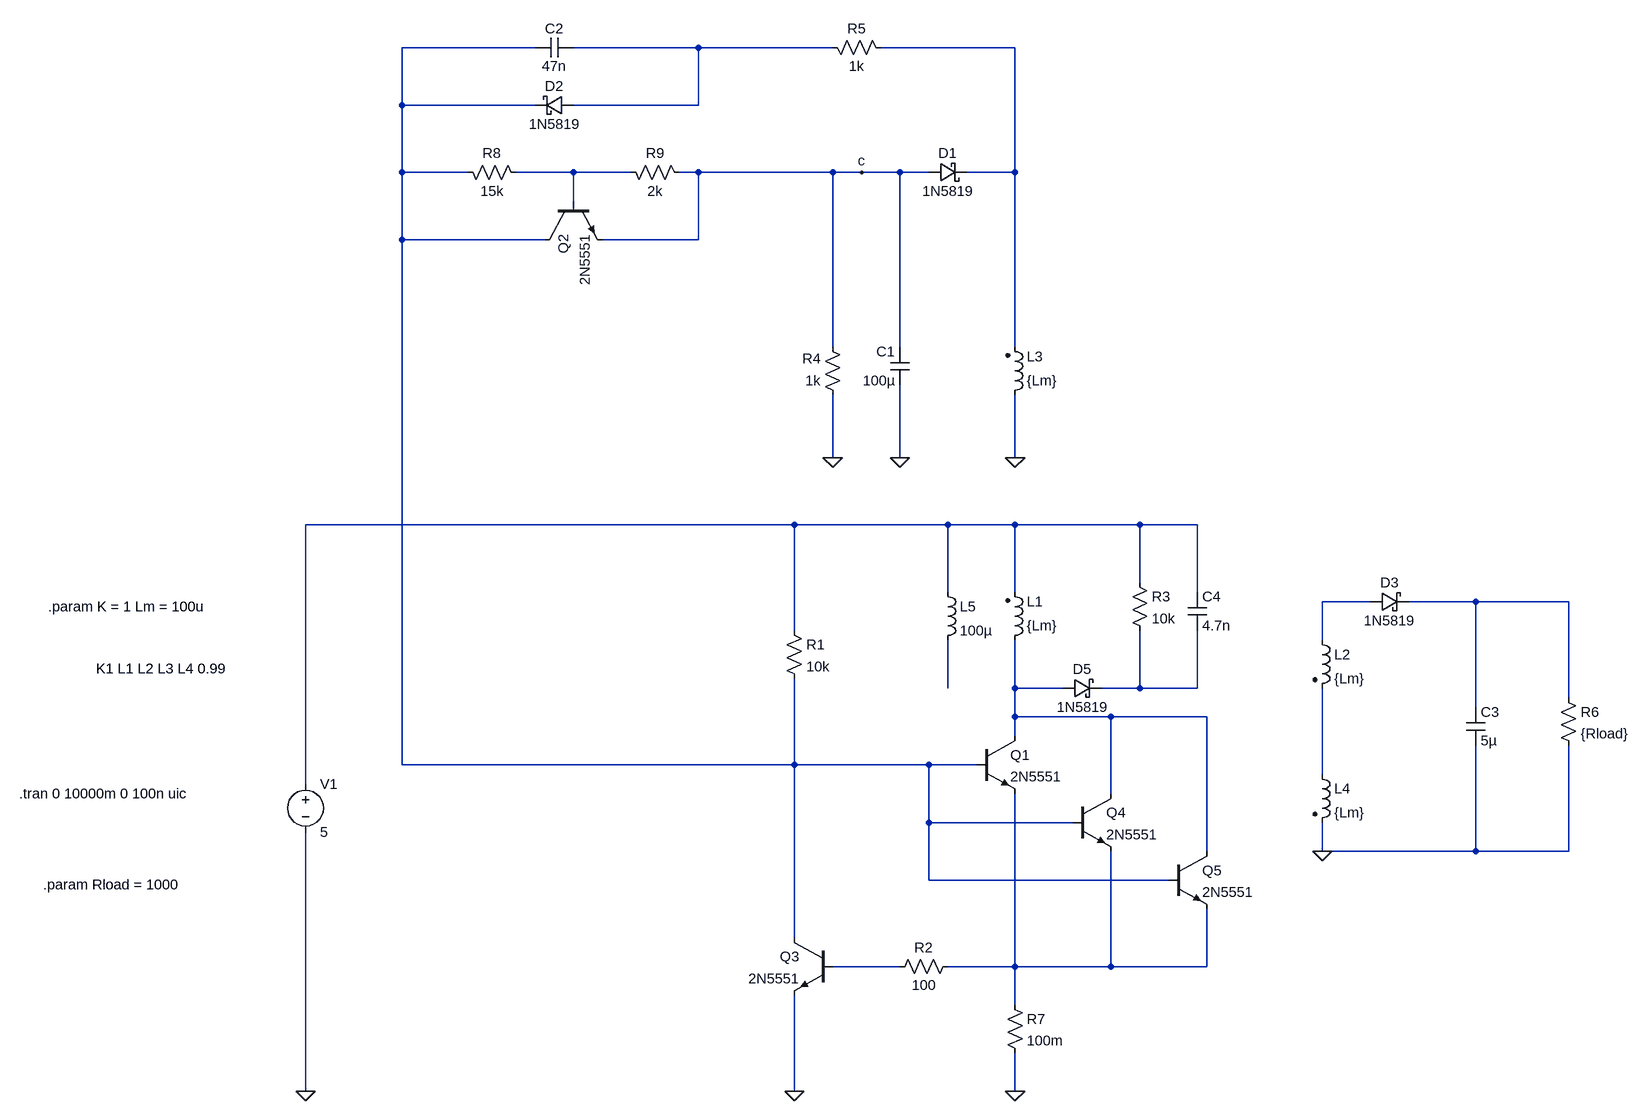
[diagram p0: schematic self_flyback_v5.asc]
self_flyback_v5.asc, the LTspice schematic file:
Version 4
SHEET 1 2740 1060
WIRE 16 -1120 -224 -1120
WIRE 288 -1120 80 -1120
WIRE 512 -1120 288 -1120
WIRE 816 -1120 592 -1120
WIRE -224 -1024 -224 -1120
WIRE 16 -1024 -224 -1024
WIRE 288 -1024 288 -1120
WIRE 288 -1024 80 -1024
WIRE -224 -912 -224 -1024
WIRE -96 -912 -224 -912
WIRE 80 -912 -16 -912
WIRE 176 -912 80 -912
WIRE 288 -912 256 -912
WIRE 512 -912 288 -912
WIRE 560 -912 512 -912
WIRE 624 -912 560 -912
WIRE 672 -912 624 -912
WIRE 816 -912 816 -1120
WIRE 816 -912 736 -912
WIRE 80 -864 80 -912
WIRE -224 -800 -224 -912
WIRE 32 -800 -224 -800
WIRE 288 -800 288 -912
WIRE 288 -800 128 -800
WIRE 512 -576 512 -912
WIRE 624 -576 624 -912
WIRE 816 -576 816 -912
WIRE 512 -368 512 -496
WIRE 624 -368 624 -512
WIRE 816 -368 816 -496
WIRE 448 -256 -1072 -256
WIRE 704 -256 448 -256
WIRE 816 -256 704 -256
WIRE 1024 -256 816 -256
WIRE 1120 -256 1024 -256
WIRE 1024 -160 1024 -256
WIRE 704 -144 704 -256
WIRE 816 -144 816 -256
WIRE 1120 -144 1120 -256
WIRE 1408 -128 1328 -128
WIRE 1584 -128 1472 -128
WIRE 1952 -128 1584 -128
WIRE 448 -80 448 -256
WIRE 1328 -64 1328 -128
WIRE 704 16 704 -64
WIRE 816 16 816 -64
WIRE 896 16 816 16
WIRE 1024 16 1024 -80
WIRE 1024 16 960 16
WIRE 1120 16 1120 -80
WIRE 1120 16 1024 16
WIRE 1952 32 1952 -128
WIRE 1584 48 1584 -128
WIRE 816 64 816 16
WIRE 976 64 816 64
WIRE 1136 64 976 64
WIRE 816 96 816 64
WIRE -224 144 -224 -800
WIRE 448 144 448 0
WIRE 448 144 -224 144
WIRE 672 144 448 144
WIRE 752 144 672 144
WIRE 1328 160 1328 16
WIRE -1072 176 -1072 -256
WIRE 976 192 976 64
WIRE 672 240 672 144
WIRE 912 240 672 240
WIRE 1136 288 1136 64
WIRE 1328 288 1328 240
WIRE 1584 288 1584 112
WIRE 1584 288 1328 288
WIRE 1952 288 1952 112
WIRE 1952 288 1584 288
WIRE 672 336 672 240
WIRE 1072 336 672 336
WIRE 448 432 448 144
WIRE 624 480 512 480
WIRE 816 480 816 192
WIRE 816 480 704 480
WIRE 976 480 976 288
WIRE 976 480 816 480
WIRE 1136 480 1136 384
WIRE 1136 480 976 480
WIRE 816 544 816 480
WIRE -1072 688 -1072 256
WIRE 448 688 448 528
WIRE 816 688 816 624
FLAG 448 688 0
FLAG 624 -368 0
FLAG -1072 688 0
FLAG 1328 288 0
FLAG 560 -912 c
FLAG 816 688 0
FLAG 816 -368 0
FLAG 512 -368 0
SYMBOL npn 752 96 R0
SYMATTR InstName Q1
SYMATTR Value 2N5551
SYMBOL res 432 -96 R0
SYMATTR InstName R1
SYMATTR Value 10k
SYMBOL res 720 464 R90
WINDOW 0 0 56 VBottom 2
WINDOW 3 32 56 VTop 2
SYMATTR InstName R2
SYMATTR Value 100
SYMBOL voltage -1072 160 R0
WINDOW 123 0 0 Left 0
WINDOW 39 0 0 Left 0
SYMATTR InstName V1
SYMATTR Value 5
SYMBOL ind2 800 -48 M180
WINDOW 0 36 80 Left 2
WINDOW 3 36 40 Left 2
SYMATTR InstName L1
SYMATTR Value {Lm}
SYMATTR Type ind
SYMBOL ind2 1312 -80 R0
SYMATTR InstName L2
SYMATTR Value {Lm}
SYMATTR Type ind
SYMBOL ind2 800 -480 M180
WINDOW 0 36 80 Left 2
WINDOW 3 36 40 Left 2
SYMATTR InstName L3
SYMATTR Value {Lm}
SYMATTR Type ind
SYMBOL cap 640 -576 M0
SYMATTR InstName C1
SYMATTR Value 100µ
SYMBOL cap 16 -1136 M90
WINDOW 0 0 32 VBottom 2
WINDOW 3 32 32 VTop 2
SYMATTR InstName C2
SYMATTR Value 47n
SYMBOL res 608 -1104 M270
WINDOW 0 32 56 VTop 2
WINDOW 3 0 56 VBottom 2
SYMATTR InstName R5
SYMATTR Value 1k
SYMBOL res 1936 16 R0
SYMATTR InstName R6
SYMATTR Value {Rload}
SYMBOL cap 1568 48 R0
SYMATTR InstName C3
SYMATTR Value 5µ
SYMBOL res 800 528 R0
SYMATTR InstName R7
SYMATTR Value 100m
SYMBOL res 528 -480 R180
WINDOW 0 36 76 Left 2
WINDOW 3 36 40 Left 2
SYMATTR InstName R4
SYMATTR Value 1k
SYMBOL cap 1104 -144 R0
SYMATTR InstName C4
SYMATTR Value 4.7n
SYMBOL res 1008 -176 R0
SYMATTR InstName R3
SYMATTR Value 10k
SYMBOL schottky 1408 -112 R270
WINDOW 0 32 32 VTop 2
WINDOW 3 0 32 VBottom 2
SYMATTR InstName D3
SYMATTR Value 1N5819
SYMATTR Description Diode
SYMATTR Type diode
SYMBOL ind 688 -160 R0
SYMATTR InstName L5
SYMATTR Value 100µ
SYMBOL ind2 1312 144 R0
SYMATTR InstName L4
SYMATTR Value {Lm}
SYMATTR Type ind
SYMBOL schottky 896 32 R270
WINDOW 0 32 32 VTop 2
WINDOW 3 0 32 VBottom 2
SYMATTR InstName D5
SYMATTR Value 1N5819
SYMATTR Description Diode
SYMATTR Type diode
SYMBOL npn 512 432 M0
SYMATTR InstName Q3
SYMATTR Value 2N5551
SYMBOL npn 32 -864 M90
SYMATTR InstName Q2
SYMATTR Value 2N5551
SYMBOL res -112 -928 M90
WINDOW 0 0 56 VBottom 2
WINDOW 3 32 56 VTop 2
SYMATTR InstName R8
SYMATTR Value 15k
SYMBOL res 160 -928 M90
WINDOW 0 0 56 VBottom 2
WINDOW 3 32 56 VTop 2
SYMATTR InstName R9
SYMATTR Value 2k
SYMBOL npn 912 192 R0
SYMATTR InstName Q4
SYMATTR Value 2N5551
SYMBOL npn 1072 288 R0
SYMATTR InstName Q5
SYMATTR Value 2N5551
SYMBOL schottky 672 -928 M90
WINDOW 0 0 32 VBottom 2
WINDOW 3 32 32 VTop 2
SYMATTR InstName D1
SYMATTR Value 1N5819
SYMATTR Description Diode
SYMATTR Type diode
SYMBOL schottky 80 -1008 M270
WINDOW 0 32 32 VTop 2
WINDOW 3 0 32 VBottom 2
SYMATTR InstName D2
SYMATTR Value 1N5819
SYMATTR Description Diode
SYMATTR Type diode
TEXT -1856 192 Left 2 !.tran 0 10000m 0 100n uic
TEXT -1728 -16 Left 2 !K1 L1 L2 L3 L4 0.99
TEXT -1808 -120 Left 2 !.param K = 1 Lm = 100u
TEXT -1816 344 Left 2 !.param Rload = 1000

The netlist it stands for:
* self_flyback_v5.asc
Q1 N009 N001 N013 0 2N5551
R1 N005 N001 10k
R2 N013 N012 100
V1 N005 0 5
L1 N009 N005 {Lm}
L2 N006 N011 {Lm}
L3 0 N003 {Lm}
C1 c 0 100µ
C2 N001 N002 47n
R5 N003 N002 1k
R6 N007 0 {Rload}
C3 N007 0 5µ
R7 N013 0 100m
R4 0 c 1k
C4 N005 N010 4.7n
R3 N005 N010 10k
D3 N006 N007 1N5819
L5 N005 N008 100µ
L4 N011 0 {Lm}
D5 N009 N010 1N5819
Q3 N001 N012 0 0 2N5551
Q2 N001 N004 c 0 2N5551
R8 N001 N004 15k
R9 N004 c 2k
Q4 N009 N001 N013 0 2N5551
Q5 N009 N001 N013 0 2N5551
D1 c N003 1N5819
D2 N002 N001 1N5819
.model D D
.lib standard.dio
.model NPN NPN
.model PNP PNP
.lib standard.bjt
.tran 0 10000m 0 100n uic
K1 L1 L2 L3 L4 0.99
.param K = 1 Lm = 100u
.param Rload = 1000
.backanno
.end